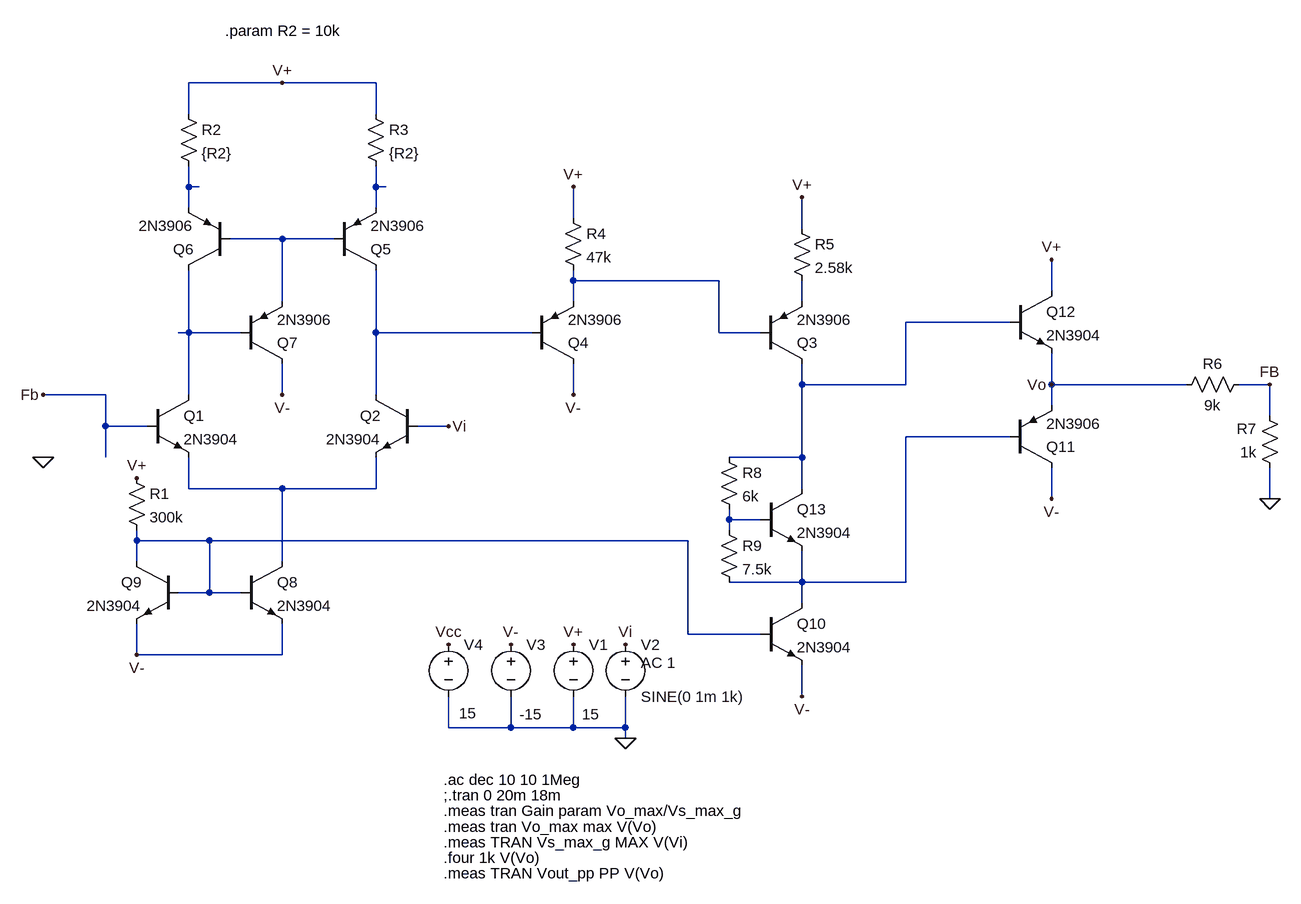
[diagram p0: schematic Lab 5 - Diff Amp V4.asc]
Lab 5 - Diff Amp V4.asc, the LTspice schematic file:
Version 4
SHEET 1 2024 704
WIRE 448 -976 304 -976
WIRE 592 -976 448 -976
WIRE 304 -928 304 -976
WIRE 592 -928 592 -976
WIRE 304 -816 304 -848
WIRE 320 -816 304 -816
WIRE 592 -816 592 -848
WIRE 608 -816 592 -816
WIRE 304 -784 304 -816
WIRE 592 -784 592 -816
WIRE 896 -768 896 -816
WIRE 1248 -752 1248 -800
WIRE 448 -736 368 -736
WIRE 528 -736 448 -736
WIRE 896 -672 896 -688
WIRE 1120 -672 896 -672
WIRE 1632 -656 1632 -704
WIRE 448 -640 448 -736
WIRE 896 -640 896 -672
WIRE 1248 -640 1248 -672
WIRE 1568 -608 1408 -608
WIRE 304 -592 304 -688
WIRE 304 -592 288 -592
WIRE 384 -592 304 -592
WIRE 592 -592 592 -688
WIRE 832 -592 592 -592
WIRE 1120 -592 1120 -672
WIRE 1184 -592 1120 -592
WIRE 1248 -512 1248 -544
WIRE 1408 -512 1408 -608
WIRE 1408 -512 1248 -512
WIRE 1632 -512 1632 -560
WIRE 1840 -512 1632 -512
WIRE 1968 -512 1920 -512
WIRE 176 -496 80 -496
WIRE 304 -496 304 -592
WIRE 448 -496 448 -544
WIRE 592 -496 592 -592
WIRE 896 -496 896 -544
WIRE 1632 -480 1632 -512
WIRE 1968 -464 1968 -512
WIRE 176 -448 176 -496
WIRE 240 -448 176 -448
WIRE 704 -448 656 -448
WIRE 1568 -432 1408 -432
WIRE 176 -400 176 -448
WIRE 1248 -400 1248 -512
WIRE 1248 -400 1136 -400
WIRE 304 -352 304 -400
WIRE 448 -352 304 -352
WIRE 592 -352 592 -400
WIRE 592 -352 448 -352
WIRE 1248 -352 1248 -400
WIRE 1632 -336 1632 -384
WIRE 1968 -336 1968 -384
WIRE 1136 -304 1136 -320
WIRE 1184 -304 1136 -304
WIRE 1136 -288 1136 -304
WIRE 224 -272 224 -288
WIRE 336 -272 224 -272
WIRE 1072 -272 336 -272
WIRE 224 -240 224 -272
WIRE 448 -240 448 -352
WIRE 1248 -208 1248 -256
WIRE 1248 -208 1136 -208
WIRE 1408 -208 1408 -432
WIRE 1408 -208 1248 -208
WIRE 336 -192 336 -272
WIRE 336 -192 288 -192
WIRE 384 -192 336 -192
WIRE 1248 -176 1248 -208
WIRE 1072 -128 1072 -272
WIRE 1184 -128 1072 -128
WIRE 224 -96 224 -144
WIRE 448 -96 448 -144
WIRE 448 -96 224 -96
WIRE 1248 -32 1248 -80
WIRE 704 16 704 -32
WIRE 800 16 800 -32
WIRE 800 16 704 16
WIRE 896 16 896 -32
WIRE 896 16 800 16
WIRE 976 16 976 -32
WIRE 976 16 896 16
WIRE 976 32 976 16
FLAG 896 -112 V+
FLAG 976 32 0
FLAG 976 -112 Vi
FLAG 800 -112 V-
FLAG 704 -112 Vcc
FLAG 704 -448 Vi
FLAG 448 -976 V+
FLAG 448 -496 V-
FLAG 224 -368 V+
FLAG 1248 -800 V+
FLAG 224 -96 V-
FLAG 1248 -32 V-
FLAG 1632 -336 V-
FLAG 1632 -704 V+
FLAG 1632 -512 Vo
FLAG 896 -496 V-
FLAG 896 -816 V+
FLAG 1968 -336 0
FLAG 1968 -512 FB
FLAG 80 -400 0
FLAG 80 -496 Fb
DATAFLAG 608 -816 ""
DATAFLAG 320 -816 ""
DATAFLAG 448 -352 ""
DATAFLAG 1376 -512 ""
DATAFLAG 704 -592 ""
DATAFLAG 288 -592 ""
DATAFLAG 1072 -672 ""
DATAFLAG 1008 -272 ""
DATAFLAG 1728 -512 ""
DATAFLAG 1248 -48 "Ic(Q10)"
DATAFLAG 1424 -432 ""
DATAFLAG 448 -736 ""
SYMBOL voltage 896 -128 R0
WINDOW 3 13 123 Left 2
SYMATTR Value 15
SYMATTR InstName V1
SYMBOL voltage 976 -128 R0
WINDOW 123 24 44 Left 2
WINDOW 39 0 0 Left 0
SYMATTR Value2 AC 1
SYMATTR InstName V2
SYMATTR Value SINE(0 1m 1k)
SYMBOL voltage 800 -128 R0
WINDOW 3 13 123 Left 2
SYMATTR Value -15
SYMATTR InstName V3
SYMBOL voltage 704 -128 R0
WINDOW 3 16 122 Left 2
WINDOW 123 0 0 Left 0
WINDOW 39 0 0 Left 0
SYMATTR Value 15
SYMATTR InstName V4
SYMBOL npn 240 -496 R0
SYMATTR InstName Q1
SYMATTR Value 2N3904
SYMBOL npn 656 -496 M0
SYMATTR InstName Q2
SYMATTR Value 2N3904
SYMBOL res 288 -944 R0
SYMATTR InstName R2
SYMATTR Value {R2}
SYMBOL res 576 -944 R0
SYMATTR InstName R3
SYMATTR Value {R2}
SYMBOL res 1232 -768 R0
SYMATTR InstName R5
SYMATTR Value 2.58k
SYMBOL pnp 1184 -544 M180
SYMATTR InstName Q3
SYMATTR Value 2N3906
SYMBOL pnp 528 -688 M180
SYMATTR InstName Q5
SYMATTR Value 2N3906
SYMBOL pnp 368 -688 R180
SYMATTR InstName Q6
SYMATTR Value 2N3906
SYMBOL pnp 384 -544 M180
SYMATTR InstName Q7
SYMATTR Value 2N3906
SYMBOL npn 384 -240 R0
SYMATTR InstName Q8
SYMATTR Value 2N3904
SYMBOL npn 288 -240 M0
SYMATTR InstName Q9
SYMATTR Value 2N3904
SYMBOL res 208 -384 R0
SYMATTR InstName R1
SYMATTR Value 300k
SYMBOL npn 1184 -176 R0
SYMATTR InstName Q10
SYMATTR Value 2N3904
SYMBOL pnp 1568 -384 M180
SYMATTR InstName Q11
SYMATTR Value 2N3906
SYMBOL npn 1568 -656 R0
SYMATTR InstName Q12
SYMATTR Value 2N3904
SYMBOL pnp 832 -544 M180
SYMATTR InstName Q4
SYMATTR Value 2N3906
SYMBOL res 880 -784 R0
SYMATTR InstName R4
SYMATTR Value 47k
SYMBOL res 1936 -528 R90
WINDOW 0 0 56 VBottom 2
WINDOW 3 32 56 VTop 2
SYMATTR InstName R6
SYMATTR Value 9k
SYMBOL res 1984 -368 R180
WINDOW 0 36 76 Left 2
WINDOW 3 36 40 Left 2
SYMATTR InstName R7
SYMATTR Value 1k
SYMBOL npn 1184 -352 R0
SYMATTR InstName Q13
SYMATTR Value 2N3904
SYMBOL res 1120 -416 R0
SYMATTR InstName R8
SYMATTR Value 6k
SYMBOL res 1120 -304 R0
SYMATTR InstName R9
SYMATTR Value 7.5k
TEXT 696 192 Left 2 !.meas TRAN Vs_max_g MAX V(Vi)
TEXT 696 168 Left 2 !.meas tran Vo_max max V(Vo)
TEXT 696 144 Left 2 !.meas tran Gain param Vo_max/Vs_max_g
TEXT 696 96 Left 2 !.ac dec 10 10 1Meg
TEXT 696 120 Left 2 !;.tran 0 20m 18m
TEXT 696 216 Left 2 !.four 1k V(Vo)
TEXT 360 -1056 Left 2 !.param R2 = 10k
TEXT 696 240 Left 2 !.meas TRAN Vout_pp PP V(Vo)

The netlist it stands for:
* Lab 5 - Diff Amp V4.asc
V1 V+ 0 15
V2 Vi 0 SINE(0 1m 1k) AC 1
V3 V- 0 -15
V4 Vcc 0 15
Q1 N007 FB N010 0 2N3904
Q2 N008 Vi N010 0 2N3904
R2 V+ N001 {R2}
R3 V+ N002 {R2}
R5 V+ N005 2.58k
Q3 N006 N004 N005 0 2N3906
Q5 N008 N003 N002 0 2N3906
Q6 N007 N003 N001 0 2N3906
Q7 V- N007 N003 0 2N3906
Q8 N010 N012 V- 0 2N3904
Q9 N012 N012 V- 0 2N3904
R1 V+ N012 300k
Q10 N009 N012 V- 0 2N3904
Q11 V- N009 Vo 0 2N3906
Q12 V+ N006 Vo 0 2N3904
Q4 V- N008 N004 0 2N3906
R4 V+ N004 47k
R6 FB Vo 9k
R7 0 FB 1k
Q13 N006 N011 N009 0 2N3904
R8 N006 N011 6k
R9 N011 N009 7.5k
.model NPN NPN
.model PNP PNP
.lib standard.bjt
.meas TRAN Vs_max_g MAX V(Vi)
.meas tran Vo_max max V(Vo)
.meas tran Gain param Vo_max/Vs_max_g
.ac dec 10 10 1Meg
;.tran 0 20m 18m
.four 1k V(Vo)
.param R2 = 10k
.meas TRAN Vout_pp PP V(Vo)
.backanno
.end